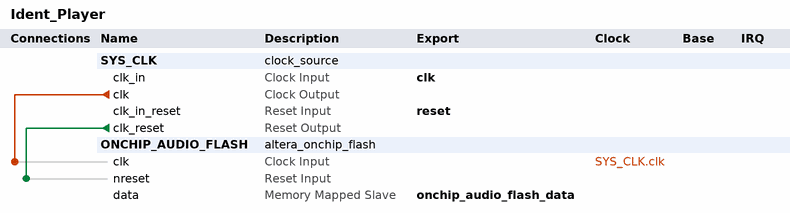
[diagram p0: system contents]
# Platform Designer (Qsys) system Ident_Player, MAX 10 10M50DAF484C7G
# Parameters at their usual value, and those the tool derives, are not listed.
package require -exact qsys 23.1
create_system Ident_Player
set_project_property DEVICE_FAMILY {MAX 10}
set_project_property DEVICE 10M50DAF484C7G

add_instance SYS_CLK clock_source 23.1
set_instance_parameter_value SYS_CLK clockFrequency 50000000

add_instance ONCHIP_AUDIO_FLASH altera_onchip_flash 23.1
set_instance_parameter_value ONCHIP_AUDIO_FLASH CLOCK_FREQUENCY 50.0
set_instance_parameter_value ONCHIP_AUDIO_FLASH CONFIGURATION_MODE {Single Compressed Image}
set_instance_parameter_value ONCHIP_AUDIO_FLASH SECTOR_ACCESS_MODE {Read only,Read only,Read only,Read only,Hidden}
set_instance_parameter_value ONCHIP_AUDIO_FLASH initFlashContent false
set_instance_parameter_value ONCHIP_AUDIO_FLASH useNonDefaultInitFile true

# connections
add_connection SYS_CLK.clk ONCHIP_AUDIO_FLASH.clk clock
add_connection SYS_CLK.clk_reset ONCHIP_AUDIO_FLASH.nreset reset

# exported interfaces
add_interface clk clock sink
set_interface_property clk EXPORT_OF SYS_CLK.clk_in
add_interface onchip_audio_flash_data avalon slave
set_interface_property onchip_audio_flash_data EXPORT_OF ONCHIP_AUDIO_FLASH.data
add_interface reset reset sink
set_interface_property reset EXPORT_OF SYS_CLK.clk_in_reset

set_interconnect_requirement {$system} qsys_mm.clockCrossingAdapter HANDSHAKE
set_interconnect_requirement {$system} qsys_mm.enableEccProtection FALSE
set_interconnect_requirement {$system} qsys_mm.insertDefaultSlave FALSE
set_interconnect_requirement {$system} qsys_mm.maxAdditionalLatency 1

save_system Ident_Player.qsys
